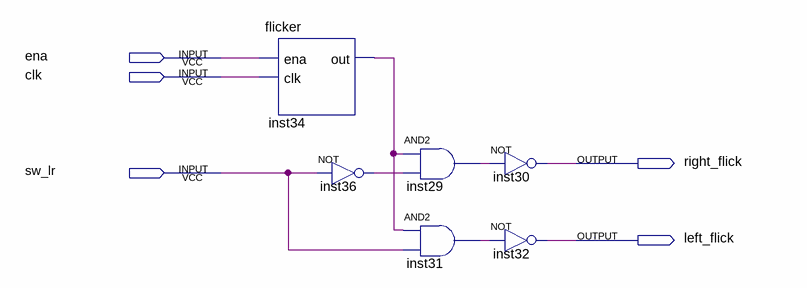
[diagram p0: schematic sheet]
// Quartus schematic flicker_sel.bdf as structural Verilog: 6 symbols, 5 pins
module flicker_sel (
  input  ena,
  input  clk,
  input  sw_lr,
  output right_flick,
  output left_flick
);

  wire inst29_out, inst31_out, inst34_out, inst36_out;

  flicker inst34 (.ena(ena), .clk(clk), .out(inst34_out));
  not inst36 (inst36_out, sw_lr);
  and inst29 (inst29_out, inst34_out, inst36_out);
  and inst31 (inst31_out, inst34_out, sw_lr);
  not inst30 (right_flick, inst29_out);
  not inst32 (left_flick, inst31_out);
endmodule
